# Altium schematic sheet LPEDT_revA1_bikeit_MCU_POWER.SchDoc: MCU Power and Decoupling
size A3; Author: Dhruva Koley; DocumentNumber: 6; Revision: 1; SheetNumber: 5; SheetTotal: 11
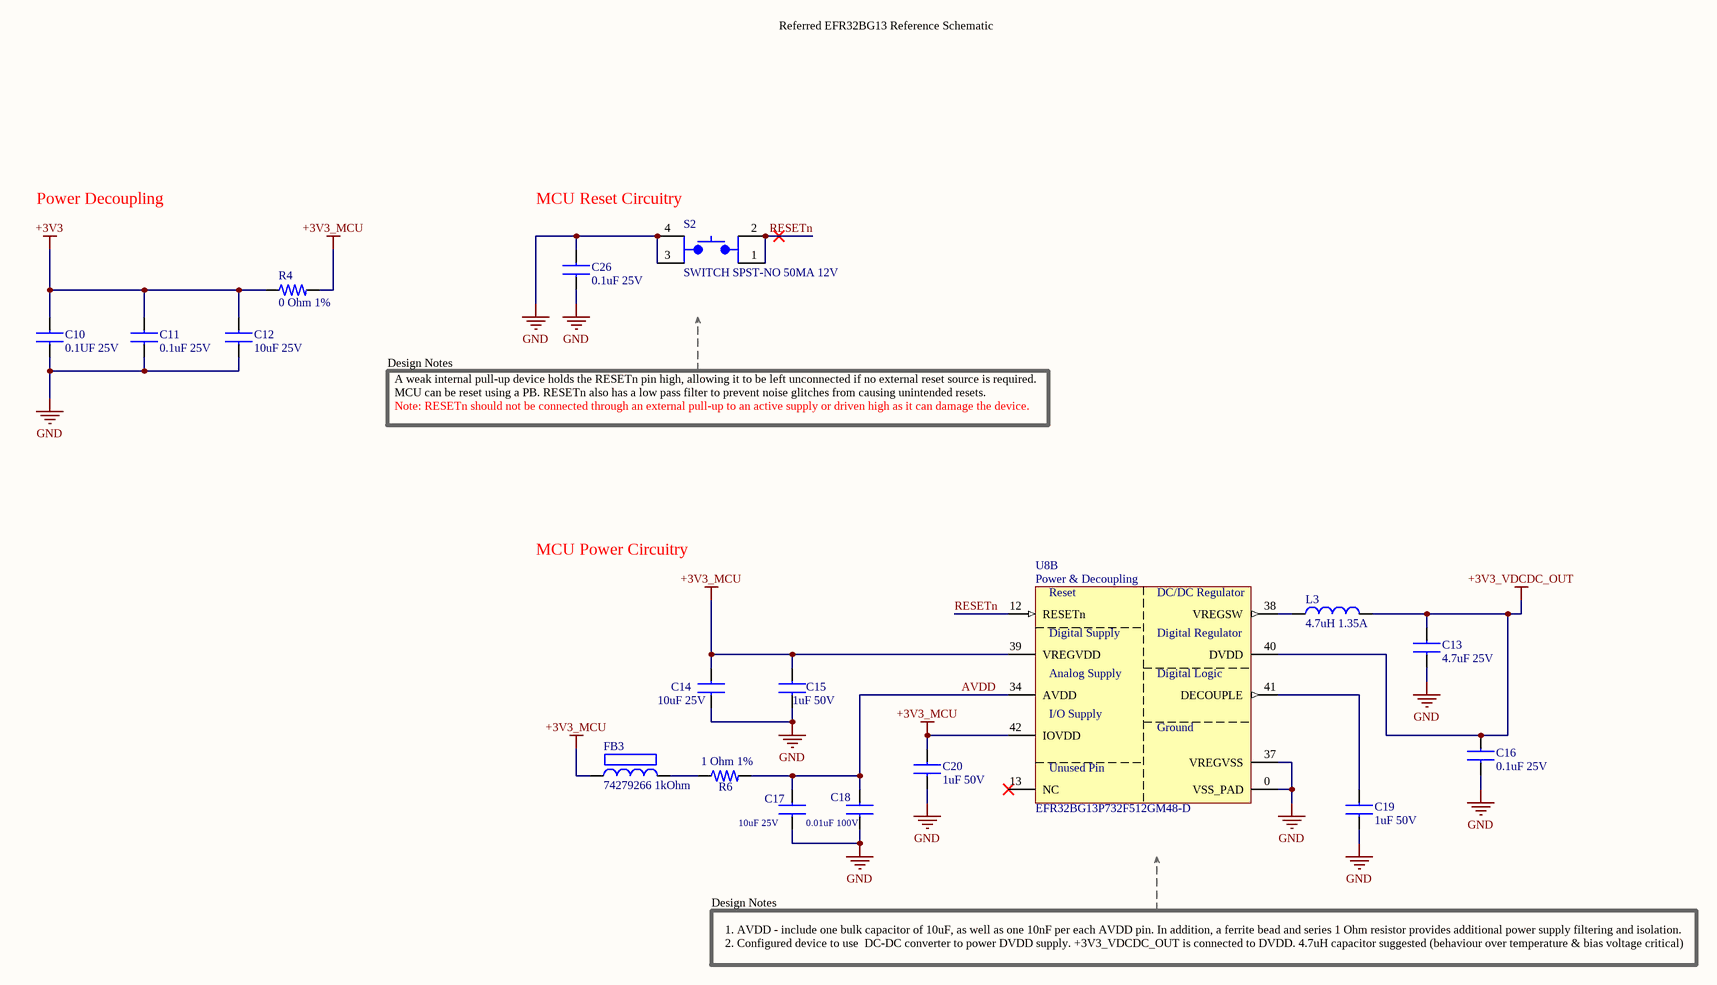
[diagram p0: LPEDT_revA1_bikeit_MCU_POWER.SchDoc]

## Parts
C10  0.1UF 25V  [CAP_0603_1.60mm*0.80mm]
C11  0.1uF 25V  [CAP_0603_1.60mm*0.80mm]
C12  10uF 25V  [CAP_0805_2MM]
C13  4.7uF 25V  [CAP_0603_1.60mm*0.80mm]
C14  10uF 25V  [CAP_0805_2MM]
C15  1uF 50V  [CAP_0603_1.60mm*0.80mm]
C16  0.1uF 25V  [CAP_0603_1.60mm*0.80mm]
C17  10uF 25V  [CAP_0805_2MM]
C18  0.01uF 100V  [CAP_0603_1.60mm*0.80mm]
C19  1uF 50V  [CAP_0603_1.60mm*0.80mm]
C20  1uF 50V  [CAP_0603_1.60mm*0.80mm]
C26  0.1uF 25V  [CAP_0603_1.60mm*0.80mm]
FB3  74279266 1kOhm  [FB_0603_1.60mm*0.80mm]
L3  4.7uH 1.35A
R4  0 Ohm 1%  [RESC1005X04N]
R6  1 Ohm 1%  [RES_0603_1608X06]
S2  SWITCH SPST-NO 50MA 12V  [SW_TL3305AF260QG]
U8  EFR32BG13P732F512GM48-D  [QFN50P700X700X90_HS-49N]  (part B of 3)

## Nets
+3V3: C10.1 C11.1 C12.1 R4.1
+3V3_MCU: C14.1 C15.1 C20.1 FB3.1 R4.2 U8.39(VREGVDD) U8.42(IOVDD)
+3V3_VDCDC_OUT: C13.1 C16.1 L3.2 U8.40(DVDD)
GND: C10.2 C11.2 C12.2 C13.2 C14.2 C15.2 C16.2 C17.2 C18.2 C19.2 C20.2 C26.1 C26.2 S2.3 S2.4 U8.0(VSS_PAD) U8.37(VREGVSS)
AVDD: C17.1 C18.1 R6.2 U8.34(AVDD)
RESETn: S2.1 S2.2 U8.12(RESETn)
NetC19_1: C19.1 U8.41(DECOUPLE)
NetFB3_2: FB3.2 R6.1
NetL3_1: L3.1 U8.38(VREGSW)

Not connected (* = marked no-connect by the designer): U8 13(NC)*

## Notes on the sheet
- Referred EFR32BG13 Reference Schematic
- Power Decoupling
- (near S2) MCU Reset Circuitry
- Design Notes
- A weak internal pull-up device holds the RESETn pin high, allowing it to be left unconnected if no external reset source is required.
- MCU can be reset using a PB. RESETn also has a low pass filter to prevent noise glitches from causing unintended resets.
- Note: RESETn should not be connected through an external pull-up to an active supply or driven high as it can damage the device.
- MCU Power Circuitry
- 1. AVDD - include one bulk capacitor of 10uF, as well as one 10nF per each AVDD pin. In addition, a ferrite bead and series 1 Ohm resistor provides additional power supply filtering and isolation.
- 2. Configured device to use  DC-DC converter to power DVDD supply. +3V3_VDCDC_OUT is connected to DVDD. 4.7uH capacitor suggested (behaviour over temperature & bias voltage critical)
- (in symbol EFR32BG13P732F512GM48-D, part B) Power & Decoupling; Reset; DC/DC Regulator; Digital Supply; Digital Regulator; Analog Supply; Digital Logic; I/O Supply; Ground; Unused Pin

## Library data of the parts
C10 C11 C16 C26 = GCJ188R71E104KA12D: CAP CER 0.1UF 25V X7R 0603; Manufacturer: Murata; Capacitance: 100nF; Tolerance: 10%; Supplier 1: Digi-Key; Manufacturer Part Number: GCJ188R71E104KA12D; RoHS: Yes; Category: Ceramic Capacitors; Stock 1: 1672; Pricing 1: 1=0.21000, 10=0.14900, 50=0.08480, 100=0.07030, 500=0.04928, 1000=0.04080 (USD); Mount: Surface Mount; Case/Package: 0603; Case Code (Imperial): 0603; Case Code (Metric): 1608; Min Operating Temperature: -55°C; Max Operating Temperature: 125°C; Features: Soft Termination; Packaging: Tape and Reel; Voltage Rating: 25V; Ratings: AEC-Q200; RoHS Compliant: Yes; ComponentLink1URL: http://search.murata.co.jp/Ceramy/image/img/A01X/G101/ENG/GCJ188R71E104KA12-01.pdf?src-supplier=Digi-Key; ComponentLink1Description: http://search.murata.co.jp/Ceramy/image/img/A01X/G101/ENG/GCJ188R71E104KA12-01.pdf?src-supplier=Digi-Key; Supplier Part Number 1: 490-16477-1-ND
C12 C14 C17 = GRM21BR61E106KA73K: CAP CER 10UF 25V X5R 0805; Manufacturer: Murata; Tolerance: 10%; Manufacturer Part Number: GRM21BR61E106KA73K; RoHS: Yes; Category: Ceramic Capacitors; Stock 1: 79269; Pricing 1: 1=0.23000, 10=0.15700, 50=0.09400, 100=0.07940, 500=0.05434, 1000=0.04807, 2500=0.04598, 5000=0.04180 (USD); Mount: Surface Mount; Case/Package: 0805; Weight: 0.000335oz; Min Operating Temperature: -55°C; Max Operating Temperature: 85°C; Packaging: Tape and Reel; Capacitance: 10uF; Voltage Rating: 25V; Package Quantity: 10000; Dielectric: X5R; Voltage Rating (DC): 25V; Length: 0.079inch; Width: 0.049inch; Thickness: 0.055inch; RoHS Compliant: Yes; ComponentLink1URL: http://www.mouser.com/ds/2/281/c02e-2905.pdf?src-supplier=Mouser; ComponentLink1Description: http://www.mouser.com/ds/2/281/c02e-2905.pdf?src-supplier=Mouser; ComponentLink2URL: http://search.murata.co.jp/Ceramy/image/img/A01X/G101/ENG/GRM21BR61E106KA73-01.pdf?src-supplier=Digi-Key; ComponentLink2Description: http://search.murata.co.jp/Ceramy/image/img/A01X/G101/ENG/GRM21BR61E106KA73-01.pdf?src-supplier=Digi-Key; ComponentLink3URL: https://search.murata.co.jp/Ceramy/image/img/A01X/G101/ENG/GRM21BR61E106KA73-01.pdf?src-supplier=Digi-Key; ComponentLink3Description: https://search.murata.co.jp/Ceramy/image/img/A01X/G101/ENG/GRM21BR61E106KA73-01.pdf?src-supplier=Digi-Key; Supplier 1: Digi-Key; Supplier Part Number 1: 490-16824-1-ND
C13 = GRM188R61E475KE11D: Cap Ceramic 0603 4.7 uF 25 V ±10 % Tolerance X5R SMT Multilayer Ceramic Capacitor; Manufacturer: Murata; Tolerance: 10%; Supplier 1: Digi-Key; Manufacturer Part Number: GRM188R61E475KE11D; RoHS: Yes; Category: Ceramic Capacitors; Stock 1: 307528; Pricing 1: 1=0.36000, 10=0.24700, 50=0.17280, 100=0.14820, 500=0.11112, 1000=0.09384 (USD); Mount: Surface Mount; Case/Package: 0603; Case Code (Metric): 1608; Case Code (Imperial): 0603; Material: Ceramic; Min Operating Temperature: -55°C; Max Operating Temperature: 85°C; Package Quantity: 4000; Packaging: Cut Tape; Capacitance: 4.7uF; Voltage Rating: 25V; Dielectric: X5R; Voltage: 25V; Voltage Rating (DC): 25V; Series: GRM; Length: 1.6mm; Width: 0.031inch; Height: 0.8mm; Thickness: 0.031inch; Depth: 0.8mm; REACH SVHC: No SVHC; Lead Free: Lead Free; RoHS Compliant: Yes; ComponentLink1URL: https://datasheet.ciiva.com/46444/1769893-46444982.pdf?src-supplier=Element14; ComponentLink1Description: https://datasheet.ciiva.com/46444/1769893-46444982.pdf?src-supplier=Element14; ComponentLink2URL: https://datasheet.ciiva.com/46444/1769893-46444983.pdf?src-supplier=Element14; ComponentLink2Description: https://datasheet.ciiva.com/46444/1769893-46444983.pdf?src-supplier=Element14; ComponentLink3URL: https://datasheet.ciiva.com/14891/partnumbering-e-01-14891103.pdf?src-supplier=Digi-Key; ComponentLink3Description: https://datasheet.ciiva.com/14891/partnumbering-e-01-14891103.pdf?src-supplier=Digi-Key; ComponentLink4URL: https://datasheet.ciiva.com/14891/partnumbering-e-01-14891102.pdf?src-supplier=Digi-Key; ComponentLink4Description: https://datasheet.ciiva.com/14891/partnumbering-e-01-14891102.pdf?src-supplier=Digi-Key; Supplier Part Number 1: 490-7203-1-ND
C15 C19 C20 = GRT188R61H105KE13D: CAP, MLCC, AEC-Q200, X5R, 1uF, 50V, 0603; Manufacturer: Murata; Tolerance: 10%; Supplier 1: Digi-Key; Manufacturer Part Number: GRT188R61H105KE13D; RoHS: Yes; Category: Ceramic Capacitors; Stock 1: 645268; Pricing 1: 1=0.26000, 10=0.17900, 50=0.10720, 100=0.09060, 500=0.06198, 1000=0.05483 (USD); Mount: Surface Mount; Case/Package: 0603; Case Code (Metric): 1608; Case Code (Imperial): 0603; Min Operating Temperature: -55°C; Max Operating Temperature: 85°C; Packaging: Tape and Reel; Capacitance: 1uF; Voltage Rating: 50V; Dielectric: X5R; Voltage Rating (DC): 50V; Length: 0.063inch; Width: 0.031inch; Thickness: 0.035inch; Ratings: AEC-Q200; RoHS Compliant: Yes; ComponentLink1URL: http://www.farnell.com/datasheets/2165959.pdf?src-supplier=Farnell; ComponentLink1Description: http://www.farnell.com/datasheets/2165959.pdf?src-supplier=Farnell; ComponentLink2URL: http://search.murata.co.jp/Ceramy/image/img/A01X/G101/ENG/GRT188R61H105KE13-01.pdf?src-supplier=Digi-Key; ComponentLink2Description: http://search.murata.co.jp/Ceramy/image/img/A01X/G101/ENG/GRT188R61H105KE13-01.pdf?src-supplier=Digi-Key; ComponentLink3URL: https://search.murata.co.jp/Ceramy/image/img/A01X/G101/ENG/GRT188R61H105KE13-01.pdf?src-supplier=Digi-Key; ComponentLink3Description: https://search.murata.co.jp/Ceramy/image/img/A01X/G101/ENG/GRT188R61H105KE13-01.pdf?src-supplier=Digi-Key; ComponentLink4URL: http://www.farnell.com/datasheets/2165959.pdf?src-supplier=Newark; ComponentLink4Description: http://www.farnell.com/datasheets/2165959.pdf?src-supplier=Newark; Supplier Part Number 1: 490-12330-1-ND
C18 = GCM188R72A103KA37D: Multilayer Ceramic Capacitor, AEC-Q200 GCM Series, 0.01 F, 10%, X7R, 100 V RoHS Compliant: Yes; Manufacturer: Murata; Capacitance: 10nF; Supplier 1: Digi-Key; Manufacturer Part Number: GCM188R72A103KA37D; RoHS: Yes; Category: Ceramic Capacitors; Stock 1: 112779; Pricing 1: 1=0.10000, 10=0.07400, 50=0.04060, 100=0.03310, 500=0.02364, 1000=0.01857 (USD); Mount: Surface Mount; Case/Package: 0603; Case Code (Imperial): 0603; Case Code (Metric): 1608; Min Operating Temperature: -55°C; Max Operating Temperature: 125°C; Tolerance: 10%; Voltage Rating: 100V; Packaging: Tape and Reel; Voltage Rating (DC): 100V; Package Quantity: 1; Dielectric: X7R; Termination: SMD/SMT; Voltage: 100V; Series: GCM; Construction: Flat; Length: 1.6mm; Width: 0.8mm; Height: 0.8mm; Thickness: 0.035inch; Depth: 0.8mm; Ratings: AEC-Q200; Radiation Hardening: No; REACH SVHC: No SVHC; Lead Free: Lead Free; RoHS Compliant: Yes; ComponentLink1URL: https://datasheet.ciiva.com/132/product-132907.pdf?src-supplier=Digi-Key; ComponentLink1Description: https://datasheet.ciiva.com/132/product-132907.pdf?src-supplier=Digi-Key; ComponentLink2URL: https://datasheet.ciiva.com/132/product-132909.pdf?src-supplier=Digi-Key; ComponentLink2Description: https://datasheet.ciiva.com/132/product-132909.pdf?src-supplier=Digi-Key; ComponentLink3URL: https://datasheet.ciiva.com/16497/product-16497251.pdf?src-supplier=Future+Electronics; ComponentLink3Description: https://datasheet.ciiva.com/16497/product-16497251.pdf?src-supplier=Future+Electronics; ComponentLink4URL: https://datasheet.ciiva.com/18183/getdatasheetpartid-178890-18183651.pdf?src-supplier=Verical; ComponentLink4Description: https://datasheet.ciiva.com/18183/getdatasheetpartid-178890-18183651.pdf?src-supplier=Verical; ComponentLink5URL: https://datasheet.ciiva.com/132/product-132908.pdf?src-supplier=Digi-Key; ComponentLink5Description: https://datasheet.ciiva.com/132/product-132908.pdf?src-supplier=Digi-Key; ComponentLink6URL: https://datasheet.ciiva.com/11786/0900766b80ef92d0-11786108.pdf?src-supplier=RSComponents; ComponentLink6Description: https://datasheet.ciiva.com/11786/0900766b80ef92d0-11786108.pdf?src-supplier=RSComponents; ComponentLink7URL: https://datasheet.ciiva.com/11619/product-11619719.pdf?src-supplier=Avnet; ComponentLink7Description: https://datasheet.ciiva.com/11619/product-11619719.pdf?src-supplier=Avnet; Supplier Part Number 1: 490-4781-1-ND
FB3 = 74279266: Ferrite Bead, 0603 [1608 Metric], 1 kohm, 200 mA, WE-CBF Series, 0.6 ohm, ± 25%; Manufacturer: Wurth Electronics; Impedance: 1kR; Current Rating: 200mA; DC Resistance (DCR): 600mR; Test Frequency: 100MHz; Inductance: 1.8nH; Shielding: Unshielded; Number of Lines: 1; Supplier 1: Digi-Key; Manufacturer Part Number: 74279266; RoHS: Yes; Category: Ferrite Beads and Chips; Stock 1: 55585; Pricing 1: 1=0.17000, 50=0.16800, 100=0.15500, 500=0.14800, 1000=0.14100, 2000=0.13400 (USD); Case/Package: SMD/SMT; Case Code (Metric): 1608; Case Code (Imperial): 0603; Core Material: Ferrite; Min Operating Temperature: -55°C; Max Operating Temperature: 125°C; Tolerance: 25%; Packaging: Tape and Reel; Series: WE-CBF; Max DC Current: 200mA; Termination: SMD/SMT; Max Current Rating: 200mA; Length: 1.6mm; Width: 0.8mm; Height: 0.8mm; Depth: 0.8mm; REACH SVHC: Unknown; Lead Free: Lead Free; RoHS Compliant: Yes; ComponentLink1URL: https://datasheet.ciiva.com/14634/0900766b801ef1d0-14634816.pdf?src-supplier=Allied+Electronics; ComponentLink1Description: https://datasheet.ciiva.com/14634/0900766b801ef1d0-14634816.pdf?src-supplier=Allied+Electronics; ComponentLink2URL: https://datasheet.ciiva.com/23763/74279266-23763009.pdf?src-supplier=Newark; ComponentLink2Description: https://datasheet.ciiva.com/23763/74279266-23763009.pdf?src-supplier=Newark; ComponentLink3URL: https://datasheet.ciiva.com/11799/0900766b801ef1d0-11799352.pdf?src-supplier=RSComponents; ComponentLink3Description: https://datasheet.ciiva.com/11799/0900766b801ef1d0-11799352.pdf?src-supplier=RSComponents; ComponentLink4URL: https://datasheet.ciiva.com/14971/74279266-14971192.pdf?src-supplier=Digi-Key; ComponentLink4Description: https://datasheet.ciiva.com/14971/74279266-14971192.pdf?src-supplier=Digi-Key; ComponentLink5URL: https://datasheet.ciiva.com/12395/74279266-221135-12395453.pdf?src-supplier=Mouser; ComponentLink5Description: https://datasheet.ciiva.com/12395/74279266-221135-12395453.pdf?src-supplier=Mouser; ComponentLink6URL: https://datasheet.ciiva.com/1466/1705901-1466509.pdf?src-supplier=Element14; ComponentLink6Description: https://datasheet.ciiva.com/1466/1705901-1466509.pdf?src-supplier=Element14; ComponentLink7URL: https://datasheet.ciiva.com/22711/1705901-22711422.pdf?src-supplier=Element14; ComponentLink7Description: https://datasheet.ciiva.com/22711/1705901-22711422.pdf?src-supplier=Element14; ComponentLink8URL: https://datasheet.ciiva.com/48698/001087059-da-01-ml-we-cbf-smd-ferrit-74279266-de-en-48698427.pdf?src-supplier=Conrad; ComponentLink8Description: https://datasheet.ciiva.com/48698/001087059-da-01-ml-we-cbf-smd-ferrit-74279266-de-en-48698427.pdf?src-supplier=Conrad; Supplier Part Number 1: 732-4484-1-ND
L3 = 744025004: Fixed Inductors WE-TPC 2828 4.7uH 1.35A .1Ohm; Manufacturer: Wurth Electronics; Core Material: Ferrite; Tolerance: 20%; Saturation Current: 1.7A; Shielding: Shielded; Self Resonant Frequency: 84MHz; DC Resistance (DCR): 120mR; Test Frequency: 100kHz; Series Resistance: 100mR; Supplier 1: Digi-Key; Manufacturer Part Number: 744025004; RoHS: Yes; Category: Fixed Inductors; Stock 1: 11683; Pricing 1: 1=1.54000, 10=1.48000, 50=1.36000, 100=1.13000, 250=1.02000 (USD); Mount: Surface Mount; Case/Package: Nonstandard; Number of Pins: 2; Min Operating Temperature: -40°C; Max Operating Temperature: 125°C; Packaging: Cut Tape; Package Quantity: 550; Resistor Type: Wirewound; Current Rating: 1.35A; Inductance: 4.7uH; Inductance Tolerance: 20%; Max DC Current: 1.35A; Termination: SMD/SMT; RMS Current (Irms): 1.35A; Length: 2.8mm; Width: 0.11inch; Height: 2.8mm; Height - Seated (Max): 0.118inch; Depth: 2.8mm; REACH SVHC: Unknown; ComponentLink1URL: https://datasheet.ciiva.com/6690/744025004-6690389.pdf?src-supplier=Digi-Key; ComponentLink1Description: https://datasheet.ciiva.com/6690/744025004-6690389.pdf?src-supplier=Digi-Key; ComponentLink2URL: https://datasheet.ciiva.com/11803/0900766b80f886b6-11803593.pdf?src-supplier=RSComponents; ComponentLink2Description: https://datasheet.ciiva.com/11803/0900766b80f886b6-11803593.pdf?src-supplier=RSComponents; ComponentLink3URL: https://datasheet.ciiva.com/4954/744025004-76625-4954718.pdf?src-supplier=Mouser; ComponentLink3Description: https://datasheet.ciiva.com/4954/744025004-76625-4954718.pdf?src-supplier=Mouser; ComponentLink4URL: https://datasheet.ciiva.com/6690/744025004-6690390.pdf?src-supplier=Digi-Key; ComponentLink4Description: https://datasheet.ciiva.com/6690/744025004-6690390.pdf?src-supplier=Digi-Key; ComponentLink5URL: https://datasheet.ciiva.com/14123/744025004-eng-tds-14123830.pdf?src-supplier=Distrelec; ComponentLink5Description: https://datasheet.ciiva.com/14123/744025004-eng-tds-14123830.pdf?src-supplier=Distrelec; ComponentLink6URL: https://datasheet.ciiva.com/6690/744025004-6690391.pdf?src-supplier=Digi-Key; ComponentLink6Description: https://datasheet.ciiva.com/6690/744025004-6690391.pdf?src-supplier=Digi-Key; ComponentLink7URL: https://datasheet.ciiva.com/7650/1243426-7650570.pdf?src-supplier=Element14; ComponentLink7Description: https://datasheet.ciiva.com/7650/1243426-7650570.pdf?src-supplier=Element14; Supplier Part Number 1: 732-2615-1-ND
R4 = RMCF0402ZT0R00: RES 0 OHM JUMPER 1/16W 0402; Manufacturer: Stackpole Electronics; Resistance: 0R; Power Rating: 63mW; Current Rating: 1A; Working Voltage: 50V; Supplier 1: Digi-Key; Manufacturer Part Number: RMCF0402ZT0R00; RoHS: Yes; Category: Chip SMD Resistors; Stock 1: 5982991; Pricing 1: 1=0.10000, 10=0.01000, 25=0.00720, 50=0.00560, 100=0.00410, 250=0.00316, 500=0.00252, 1000=0.00186, 5000=0.00133 (USD); Mount: Surface Mount; Case/Package: 0402; Case Code (Metric): 1005; Case Code (Imperial): 0402; Contact Plating: Tin,Matte; Min Operating Temperature: -55°C; Max Operating Temperature: 155°C; Packaging: Tape and Reel; Resistor Type: Thick Film; Number of Terminations: 2; Max Power Dissipation: 63mW; Features: Automotive AEC-Q200; Series: RMCF; Technology: THICK FILM; Construction: Rectangular; Length: 0.039inch; Width: 0.02inch; Height: 0.016inch; Depth: 0.5mm; Radiation Hardening: No; Military Standard: Not; Lead Free: Lead Free; RoHS Compliant: Yes; ComponentLink1URL: https://datasheet.ciiva.com/26835/getdatasheetpartid-409751-26835612.pdf?src-supplier=Verical; ComponentLink1Description: https://datasheet.ciiva.com/26835/getdatasheetpartid-409751-26835612.pdf?src-supplier=Verical
R6 = ERJ-3RQF1R0V: RES SMD 1 OHM 1% 1/10W 0603; Manufacturer: Panasonic; Resistance: 1R; Power Rating: 100mW; Temperature Coefficient: 200ppm/°C; Supplier 1: Digi-Key; Manufacturer Part Number: ERJ-3RQF1R0V; RoHS: Yes; Category: Chip SMD Resistors; Stock 1: 151763; Pricing 1: 1=0.16000, 10=0.13600, 25=0.09920, 50=0.07200, 100=0.05330, 250=0.04092, 500=0.03224, 1000=0.02232 (USD); Mount: Surface Mount; Case/Package: 0603; Number of Pins: 2; Case Code (Imperial): 0603; Case Code (Metric): 1608; Contact Plating: Tin; Weight: 7.1E-05oz; Size Code: 0603; Min Operating Temperature: -55°C; Max Operating Temperature: 125°C; Tolerance: 1%; Packaging: Tape and Reel; Package Quantity: 5000; Termination: SMD/SMT; Resistor Type: Thick Film; Number of Terminations: 2; Max Power Dissipation: 100mW; Technology: THICK FILM; Series: ERJ; Construction: Rectangular; Resistance Tolerance: 1%; Length: 1.6mm; Width: 0.8mm; Height: 0.45mm; Depth: 0.8mm; Radiation Hardening: No; REACH SVHC: No SVHC; Military Standard: Not; Lead Free: Lead Free; RoHS Compliant: Yes; ComponentLink1URL: https://datasheet.ciiva.com/11810/0900766b80eefa12-11810728.pdf?src-supplier=RSComponents; ComponentLink1Description: https://datasheet.ciiva.com/11810/0900766b80eefa12-11810728.pdf?src-supplier=RSComponents; ComponentLink2URL: https://datasheet.ciiva.com/16396/aoa0000ce3-16396837.pdf?src-supplier=Future+Electronics; ComponentLink2Description: https://datasheet.ciiva.com/16396/aoa0000ce3-16396837.pdf?src-supplier=Future+Electronics; ComponentLink3URL: https://datasheet.ciiva.com/28691/391509-28691973.pdf?src-supplier=Element14; ComponentLink3Description: https://datasheet.ciiva.com/28691/391509-28691973.pdf?src-supplier=Element14; ComponentLink4URL: https://datasheet.ciiva.com/16784/70068852-16784839.pdf?src-supplier=Allied+Electronics; ComponentLink4Description: https://datasheet.ciiva.com/16784/70068852-16784839.pdf?src-supplier=Allied+Electronics; ComponentLink5URL: https://datasheet.ciiva.com/9117/aoa0000ce3-9117368.pdf?src-supplier=Avnet; ComponentLink5Description: https://datasheet.ciiva.com/9117/aoa0000ce3-9117368.pdf?src-supplier=Avnet; ComponentLink6URL: https://datasheet.ciiva.com/24165/aoa0000ce3-72189-24165336.pdf?src-supplier=Mouser; ComponentLink6Description: https://datasheet.ciiva.com/24165/aoa0000ce3-72189-24165336.pdf?src-supplier=Mouser; ComponentLink7URL: https://datasheet.ciiva.com/30060/6aoa0000ce3-30060648.pdf?src-supplier=Onlinecomponents.com; ComponentLink7Description: https://datasheet.ciiva.com/30060/6aoa0000ce3-30060648.pdf?src-supplier=Onlinecomponents.com; ComponentLink8URL: https://datasheet.ciiva.com/6138/391509-6138777.pdf?src-supplier=Farnell; ComponentLink8Description: https://datasheet.ciiva.com/6138/391509-6138777.pdf?src-supplier=Farnell; ComponentLink9URL: https://datasheet.ciiva.com/16766/70068852-16766778.pdf?src-supplier=Allied+Electronics; ComponentLink9Description: https://datasheet.ciiva.com/16766/70068852-16766778.pdf?src-supplier=Allied+Electronics; ComponentLink10URL: https://datasheet.ciiva.com/16853/aoa0000ce3-16853436.pdf?src-supplier=Avnet+Europe; ComponentLink10Description: https://datasheet.ciiva.com/16853/aoa0000ce3-16853436.pdf?src-supplier=Avnet+Europe; ComponentLink11URL: https://datasheet.ciiva.com/43455/391509-43455868.pdf?src-supplier=Farnell; ComponentLink11Description: https://datasheet.ciiva.com/43455/391509-43455868.pdf?src-supplier=Farnell; ComponentLink12URL: https://datasheet.ciiva.com/28547/391509-28547230.pdf?src-supplier=Element14; ComponentLink12Description: https://datasheet.ciiva.com/28547/391509-28547230.pdf?src-supplier=Element14; Supplier Part Number 1: P1.0AJCT-ND
S2 = TL3305AF260QG: SWITCH TACTILE SPST-NO 50MA 12V; Manufacturer: E-Switch; Mechanical Life: 200000Cycles; Throw Configuration: SPST; Illumination Type: Non-Illuminated; Operating Force: 260gf; Switch Function: Off-Mom; Actuator Type: Standard; Switch Travel: 0.2mm; Manufacturer Part Number: TL3305AF260QG; RoHS: No; Category: Tactile Switches; Stock 1: 70002; Pricing 1: 1=0.18000, 10=0.17700, 25=0.16760, 100=0.15250, 250=0.14336, 500=0.13116, 1000=0.10980 (USD); Mount: Surface Mount; Min Operating Temperature: -20°C; Max Operating Temperature: 70°C; Packaging: Tape and Reel; Termination: Gull Wing; Lead Free: Lead Free; ComponentLink1URL: http://www.farnell.com/datasheets/2554191.pdf?src-supplier=Farnell; ComponentLink1Description: http://www.farnell.com/datasheets/2554191.pdf?src-supplier=Farnell; ComponentLink2URL: http://www.farnell.com/datasheets/2554191.pdf?src-supplier=Newark; ComponentLink2Description: http://www.farnell.com/datasheets/2554191.pdf?src-supplier=Newark; ComponentLink3URL: http://www.farnell.com/datasheets/2554191.pdf?src-supplier=Element14; ComponentLink3Description: http://www.farnell.com/datasheets/2554191.pdf?src-supplier=Element14; ComponentLink4URL: http://spec_sheets.e-switch.com/specs/P010471.pdf?src-supplier=Digi-Key; ComponentLink4Description: http://spec_sheets.e-switch.com/specs/P010471.pdf?src-supplier=Digi-Key; ComponentLink5URL: http://spec_sheets.e-switch.com/specs/P010471.pdf?src-supplier=Mouser; ComponentLink5Description: http://spec_sheets.e-switch.com/specs/P010471.pdf?src-supplier=Mouser; ComponentLink6URL: http://spec_sheets.e-switch.com/specs/P010471.pdf?src-supplier=NAC+Semi; ComponentLink6Description: http://spec_sheets.e-switch.com/specs/P010471.pdf?src-supplier=NAC+Semi; Supplier 1: Digi-Key; Supplier Part Number 1: EG5353CT-ND
U8 = EFR32BG13P732F512GM48-D: BLUE GECKO QFN48 2.4 GHZ 512KB 6; Manufacturer: Silicon Labs; Supplier 1: Digi-Key; Manufacturer Part Number: EFR32BG13P732F512GM48-D; RoHS: No; Category: RF Receivers, Transceivers; Pricing 1: 1=7.61000, 10=6.79200, 25=6.11320, 80=5.56988, 230=5.02643, 440=4.51023, 945=3.80380 (USD); ComponentLink1URL: http://www.farnell.com/datasheets/2813683.pdf?src-supplier=Farnell; ComponentLink1Description: http://www.farnell.com/datasheets/2813683.pdf?src-supplier=Farnell; Supplier Part Number 1: 336-5922-ND